# EAGLE design EurocardPowerSupply_mods (EAGLE 6.6.0)

## Sheet 1 of 3
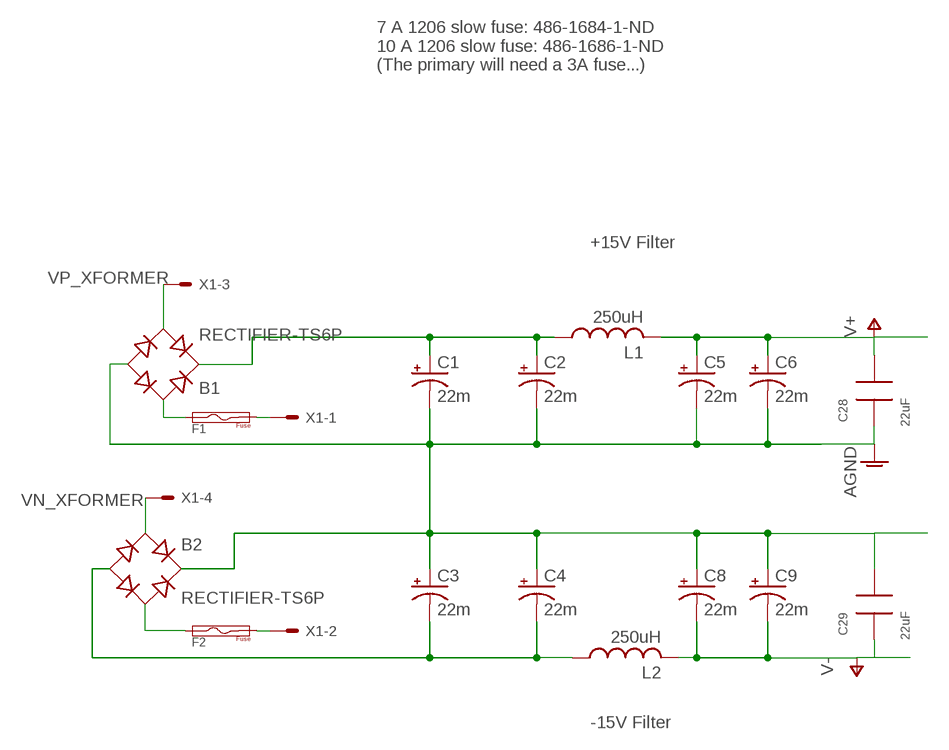
[diagram p0: schematic, sheet 1]

### Parts
B1  RECTIFIER-TS6P  [TS6P]
B2  RECTIFIER-TS6P  [TS6P]
C1  22m  CPOL-USEB35D  [EB35D]
C2  22m  CPOL-USEB35D  [EB35D]
C3  22m  CPOL-USEB35D  [EB35D]
C4  22m  CPOL-USEB35D  [EB35D]
C5  22m  CPOL-USEB35D  [EB35D]
C6  22m  CPOL-USEB35D  [EB35D]
C8  22m  CPOL-USEB35D  [EB35D]
C9  22m  CPOL-USEB35D  [EB35D]
C28  22uF  CAP1206  [1206]
C29  22uF  CAP1206  [1206]
F1  FUSE1206  [FUSE1206]
F2  FUSE1206  [FUSE1206]
L1  250uH  INDUCTOR5721-RC  [5721-RC]
L2  250uH  INDUCTOR5721-RC  [5721-RC]
X1  5566-4  [5566-4]

### Nets
AGND: B1.- B2.+ C1.- C2.- C3.+ C4.+ C5.- C6.- C8.+ C9.+ C28.1 C29.2 ; also sheet 2
N$1: B1.AC1 F1.1
N$2: F1.2 X1.1
N$3: F2.2 X1.2
N$24: B2.AC2 F2.1
V+: C5.+ C6.+ C28.2 L1.P$2 ; also sheet 2
V-: C8.- C9.- C29.1 L2.P$2 ; also sheet 2
VN_RECT: B2.- C3.- C4.- L2.P$1 ; also sheet 3
VN_XFORMER: B2.AC1 X1.4
VP_RECT: B1.+ C1.+ C2.+ L1.P$1 ; also sheet 3
VP_XFORMER: B1.AC2 X1.3

### Notes on the sheet
- 7 A 1206 slow fuse: 486-1684-1-ND
  10 A 1206 slow fuse: 486-1686-1-ND
  (The primary will need a 3A fuse...)
- +15V Filter
- -15V Filter

## Sheet 2 of 3
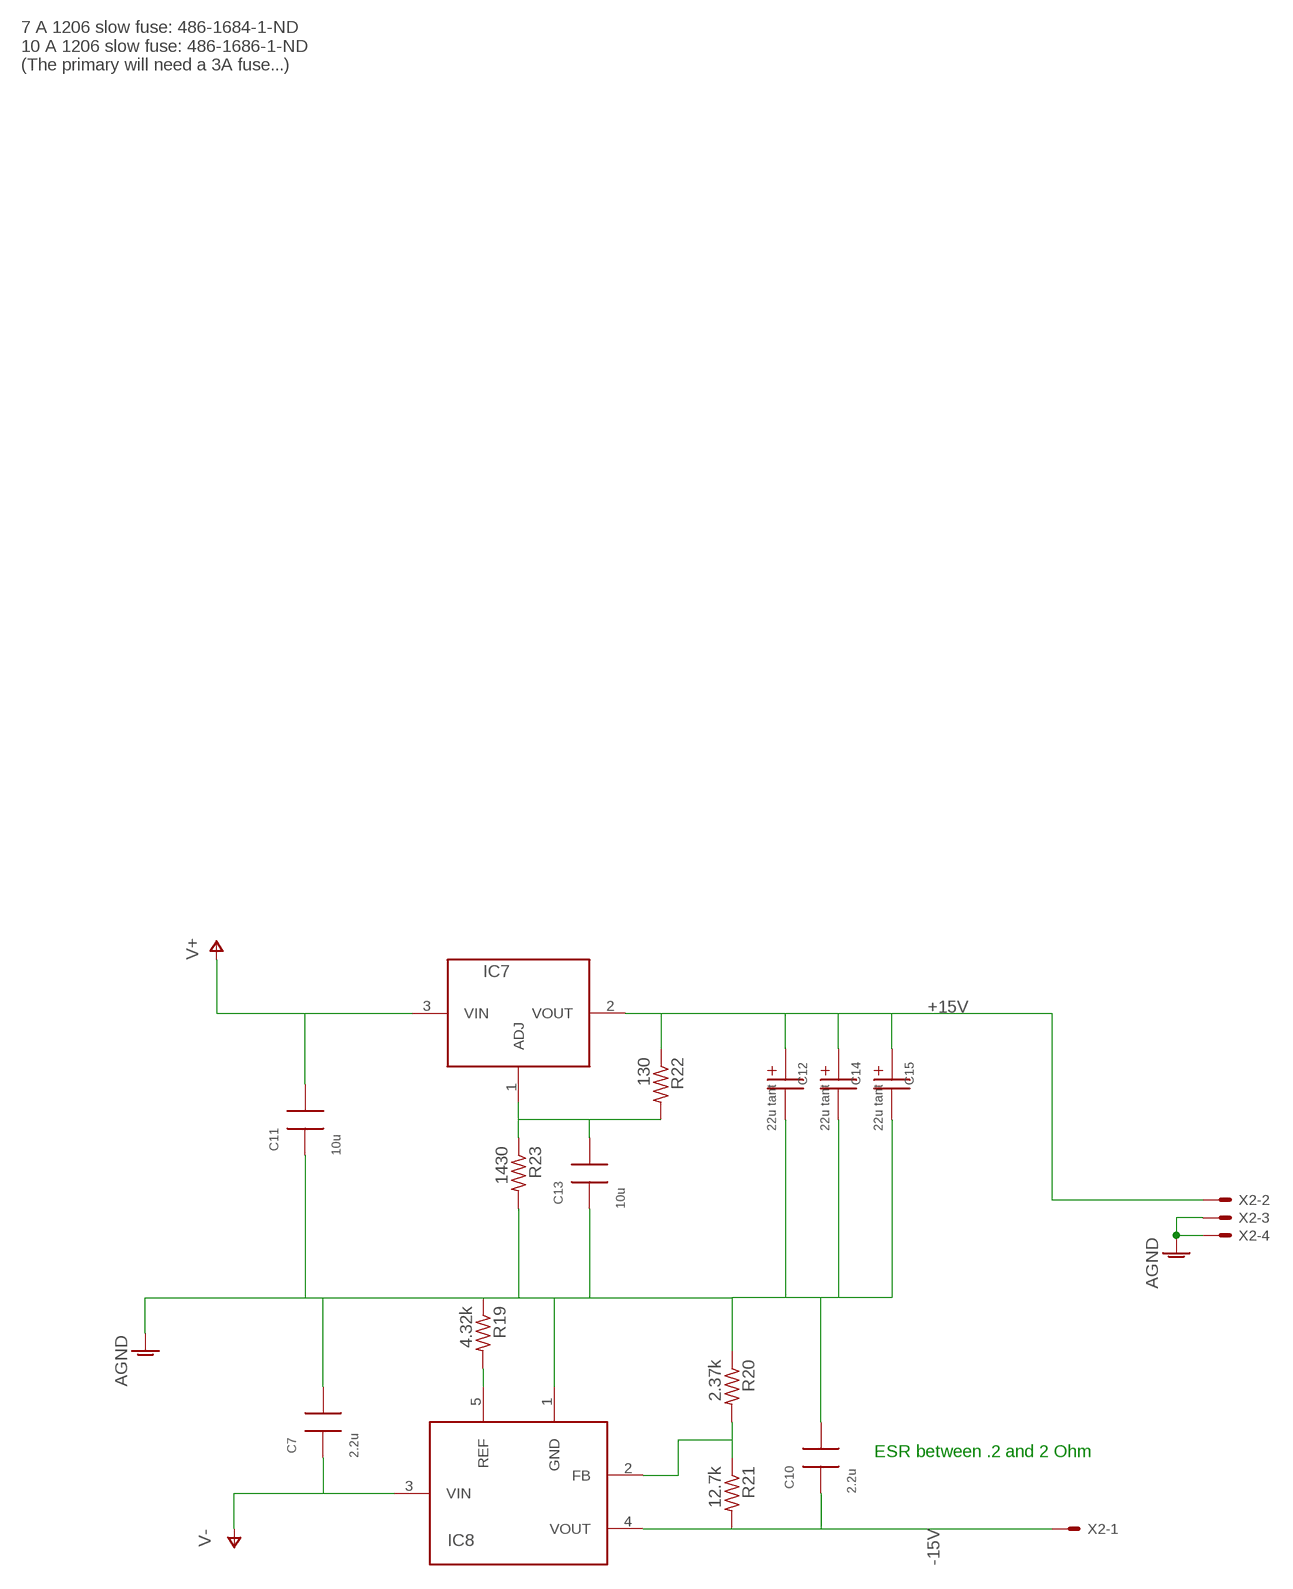
[diagram p1: schematic, sheet 2]

### Parts
C7  2.2u  CAP1206  [1206]
C10  2.2u  CAP1206  [1206]
C11  10u  CAP1206  [1206]
C12  22u tant  CAP-POL1206  [1206P]
C13  10u  CAP1206  [1206]
C14  22u tant  CAP-POL1206  [1206P]
C15  22u tant  CAP-POL1206  [1206P]
IC7  LM1084TO220  [T03B]
IC8  LT1185TO220/INLINE  [T05A]
R19  4.32k  R-US_R1206  [R1206]
R20  2.37k  R-US_R1206  [R1206]
R21  12.7k  R-US_R1206  [R1206]
R22  130  R-US_R1206  [R1206]
R23  1430  R-US_R1206  [R1206]
X2  5566-4  [5566-4]

### Nets
+15V: C12.1 C14.1 C15.1 IC7.2(VOUT) R22.1 X2.2
-15V: C10.1 IC8.4(VOUT) R21.2 X2.1
AGND: C7.2 C10.2 C11.1 C12.2 C13.1 C14.2 C15.2 IC8.1(GND) R19.1 R20.1 R23.2 X2.3 X2.4 ; also sheet 1
N$7: IC8.2(FB) R20.2 R21.1
N$9: C13.2 IC7.1(ADJ) R22.2 R23.1
N$22: IC8.5(REF) R19.2
V+: C11.2 IC7.3(VIN) ; also sheet 1
V-: C7.1 IC8.3(VIN) ; also sheet 1

### Notes on the sheet
- 7 A 1206 slow fuse: 486-1684-1-ND
  10 A 1206 slow fuse: 486-1686-1-ND
  (The primary will need a 3A fuse...)
- ESR between .2 and 2 Ohm

## Sheet 3 of 3
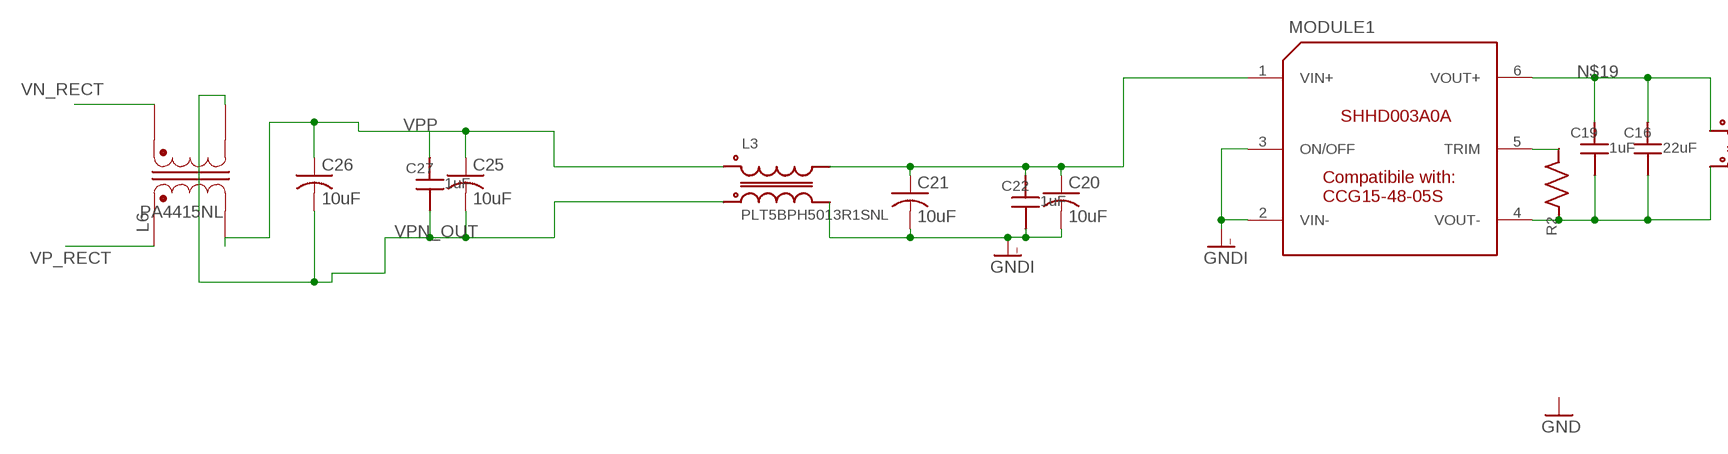
[diagram p2: schematic, sheet 3, part 1 of 2]
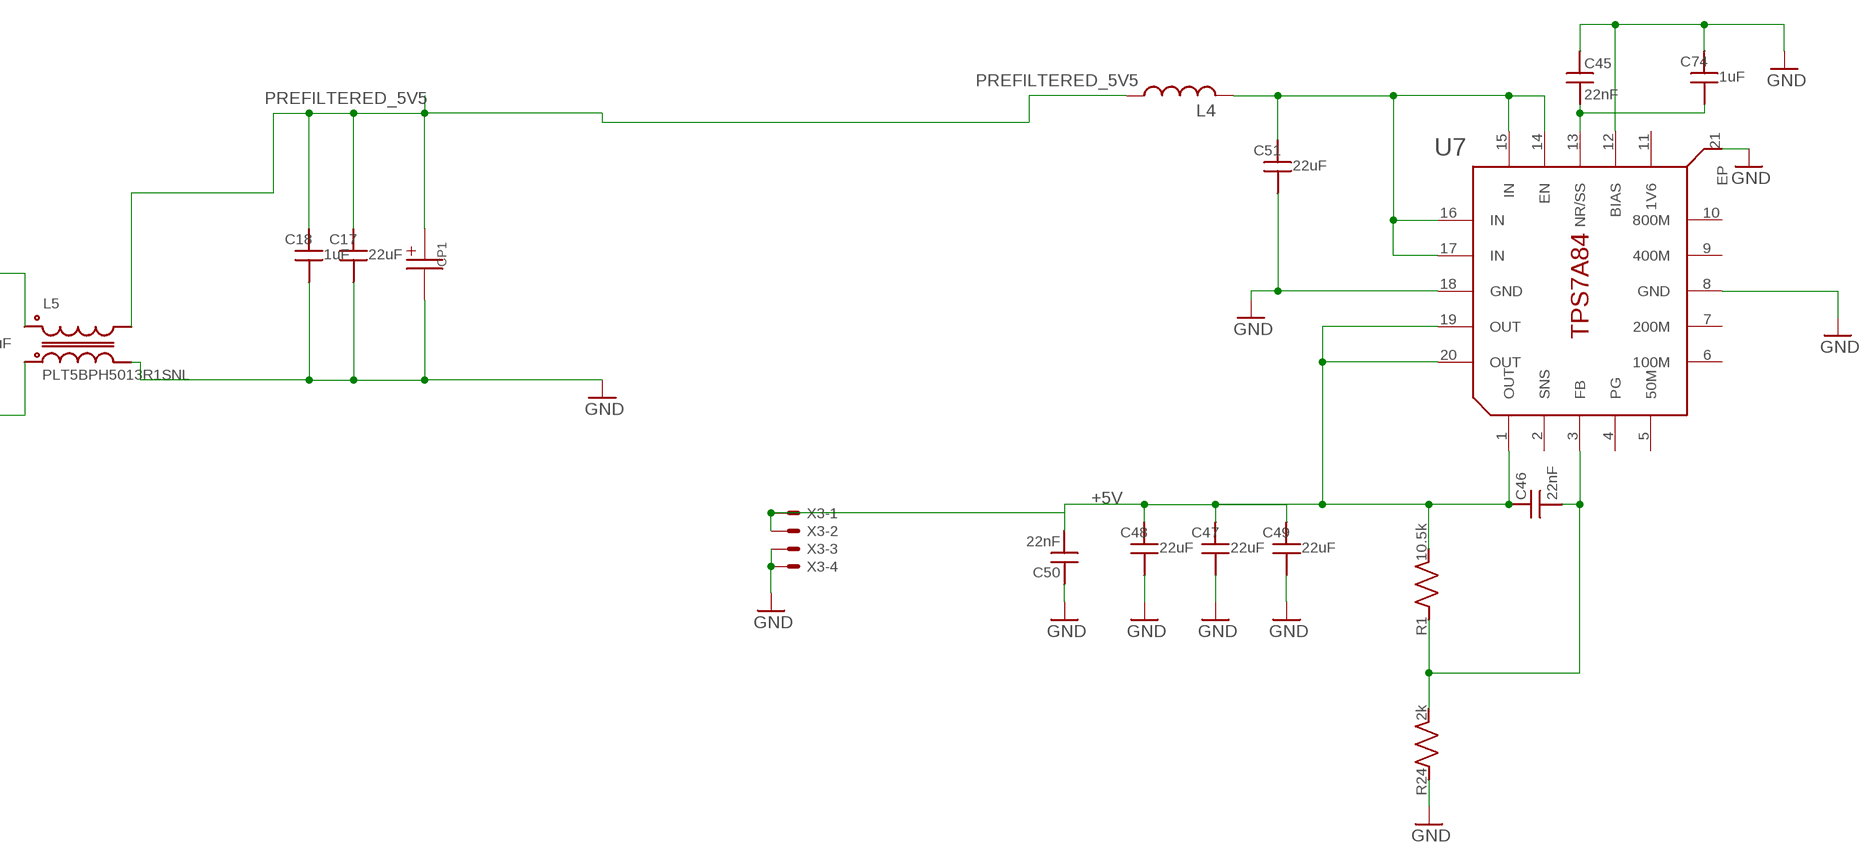
[diagram p3: schematic, sheet 3, part 2 of 2]

### Parts
C16  22uF  C_MLCC_SMDCMLCC_0805  [C_MLCC_0805]
C17  22uF  C_MLCC_SMDCMLCC_0805  [C_MLCC_0805]
C18  1uF  C_MLCC_SMDCMLCC_0805  [C_MLCC_0805]
C19  1uF  C_MLCC_SMDCMLCC_0805  [C_MLCC_0805]
C20  10uF  C-USC2220K  [C2220K]
C21  10uF  C-USC2220K  [C2220K]
C22  1uF  C_MLCC_SMDCMLCC_0805  [C_MLCC_0805]
C25  10uF  C-USC2220K  [C2220K]
C26  10uF  C-USC2220K  [C2220K]
C27  1uF  C_MLCC_SMDCMLCC_0805  [C_MLCC_0805]
C45  22nF  C_MLCC_SMDCMLCC_0306  [C_MLCC_0306]
C46  22nF  C_MLCC_SMDCMLCC_0306  [C_MLCC_0306]
C47  22uF  C_MLCC_SMDCMLCC_0805  [C_MLCC_0805]
C48  22uF  C_MLCC_SMDCMLCC_0805  [C_MLCC_0805]
C49  22uF  C_MLCC_SMDCMLCC_0805  [C_MLCC_0805]
C50  22nF  C_MLCC_SMDCMLCC_0306  [C_MLCC_0306]
C51  22uF  C_MLCC_SMDCMLCC_0805  [C_MLCC_0805]
C74  1uF  C_MLCC_SMDCMLCC_0805  [C_MLCC_0805]
CP1  CAP-POLPANASONIC_F  [PANASONIC_F]
L3  PLT5BPH5013R1SNL  MURATA_CM_COIL_SERIES_PLT5BPH  [MURATA_CM_CHOKE_PLT5BPH_SERIES]
L4  MURATA_NFZ5BBW100LN10L  [MURATA_1MHZ_3A_FERRITE]
L5  PLT5BPH5013R1SNL  MURATA_CM_COIL_SERIES_PLT5BPH  [MURATA_CM_CHOKE_PLT5BPH_SERIES]
L6  PA4415NL  [PA4415NL]
MODULE1  GE_SHHD003A0A  [GE_SHHD003A0A_THROUGH_HOLE]
R1  10.5k  R_SMDR0805  [R_0805]
R2  R_SMDR0805  [R_0805]
R24  2k  R_SMDR0805  [R_0805]
U7  TEXAS_INSTRUMENTS_TPS7A84  [S-PVQFN-N20]
X3  5566-4  [5566-4]

### Nets
+5V: C46.P$1 C47.P$1 C48.P$1 C49.P$1 C50.P$2 R1.P$2 U7.1(OUT) U7.19(OUT) U7.20(OUT) X3.1 X3.2
GND: C17.P$2 C18.P$2 C45.P$1 C47.P$2 C48.P$2 C49.P$2 C50.P$1 C51.P$2 C74.P$1 CP1.- L5.P$3 R24.P$1 U7.8(GND) U7.12(BIAS) U7.18(GND) U7.21(EP) X3.3 X3.4
GNDI: C20.2 C21.2 C22.P$2 L3.P$3 MODULE1.2(VIN-) MODULE1.3(ON/OFF)
N$10: C16.P$2 C19.P$2 L5.P$4 MODULE1.4(VOUT-) R2.P$1
N$11: MODULE1.5(TRIM) R2.P$2
N$19: C16.P$1 C19.P$1 L5.P$1 MODULE1.6(VOUT+)
N$46: C45.P$2 C74.P$2 U7.13(NR/SS)
N$47: C46.P$2 R1.P$1 R24.P$2 U7.3(FB)
N$48: C51.P$1 L4.P$2 U7.14(EN) U7.15(IN) U7.16(IN) U7.17(IN)
PREFILTERED_5V5: C17.P$1 C18.P$1 CP1.+ L4.P$1 L5.P$2
VN_RECT: L6.2 ; also sheet 1
VP_RECT: L6.1 ; also sheet 1
VPN_OUT: C25.2 C26.2 C27.P$2 L3.P$4 L6.3
VPP: C25.1 C26.1 C27.P$1 L3.P$1 L6.4
VPPI: C20.1 C21.1 C22.P$1 L3.P$2 MODULE1.1(VIN+)
Unconnected: U7.2(SNS) U7.4(PG) U7.5(50M) U7.6(100M) U7.7(200M) U7.9(400M) U7.10(800M) U7.11(1V6)

### Notes on the sheet
- Compatibile with:
  CCG15-48-05S

## Library data of the parts
B1 B2 = jqi-power-supply:RECTIFIER-: Rectifier; DIGIKEY: DFB2005-ND
C1-C6 C8 C9 = jqi-power-supply:CPOL-US; DIGIKEY: 565-2880-ND
C7 C10 C11 C13 = rlc-jqi:CAP: SMT Capacitor; DIGIKEY: 399-1249-1-ND
C12 C14 C15 = rlc-jqi:CAP-POL: Polarized SMT Capacitor; DIGIKEY: 399-1249-1-ND
C16 C17 C47-C49 C51 = jqi_passives:C_MLCC_SMD; DIGIKEY: 445-9112-1-ND
C18 C19 C22 C27 C74 = jqi_passives:C_MLCC_SMD; DIGIKEY: 587-5018-1-ND
C20 C21 C25 C26 = rcl:C-US: CAPACITOR, American symbol; DIGIKEY: 445-7947-1-ND
C28 C29 = rlc-jqi:CAP: SMT Capacitor; DIGIKEY: 445-8045-1-ND
C45 C46 C50 = jqi_passives:C_MLCC_SMD; DIGIKEY: 490-4317-1-ND
CP1 = Poe:CAP-POL: Polarized SMT Capacitor
F1 F2 = jqi-power-supply:FUSE; DIGIKEY: 486-1686-1-ND
IC7 = jqi-power-supply:LM1084: Adjustable 5A Positive Voltage Regulator; DIGIKEY: LM1084IT-ADJ/NOPB-ND
IC8 = jqi-power-supply:LT1185: Adjustable Voltage Regulator (positive/negative); DIGIKEY: LT1185CT#06PBF-ND
L1 L2 = jqi-power-supply:INDUCTOR; DIGIKEY: M8725-ND
L3 L5 = Poe:MURATA_CM_COIL_SERIES_PLT5BPH; DIGIKEY: 490-10979-1-ND; MPN: PLT5BPH5013R1SNL
L4 = Poe:MURATA_NFZ5BBW100LN10L; DIGIKEY: 490-12168-1-ND
L6 = jqi-power-supply:PA4415NL: High current common-mode choke Note: pin 3 and 4 in symbol are different from schematic in datasheet.
MODULE1 = Poe:GE_SHHD003A0A; DIGIKEY: 285-2609-ND
R1 = jqi_passives:R_SMD; DIGIKEY: 10.5k
R2 = jqi_passives:R_SMD
R19-R23 = rcl:R-US_: RESISTOR, American symbol; DIGIKEY: 541-1.5KECT-ND
R24 = jqi_passives:R_SMD; DIGIKEY: RR12P2.0KDCT-ND
U7 = Poe:TEXAS_INSTRUMENTS_TPS7A84; DIGIKEY: 296-43749-1-ND
X1-X3 = jqi-power-supply:5566-4: Mini FIT connector 4 pol Source: http://www.molex.com; OC_FARNELL: unknown; OC_NEWARK: unknown

## Board
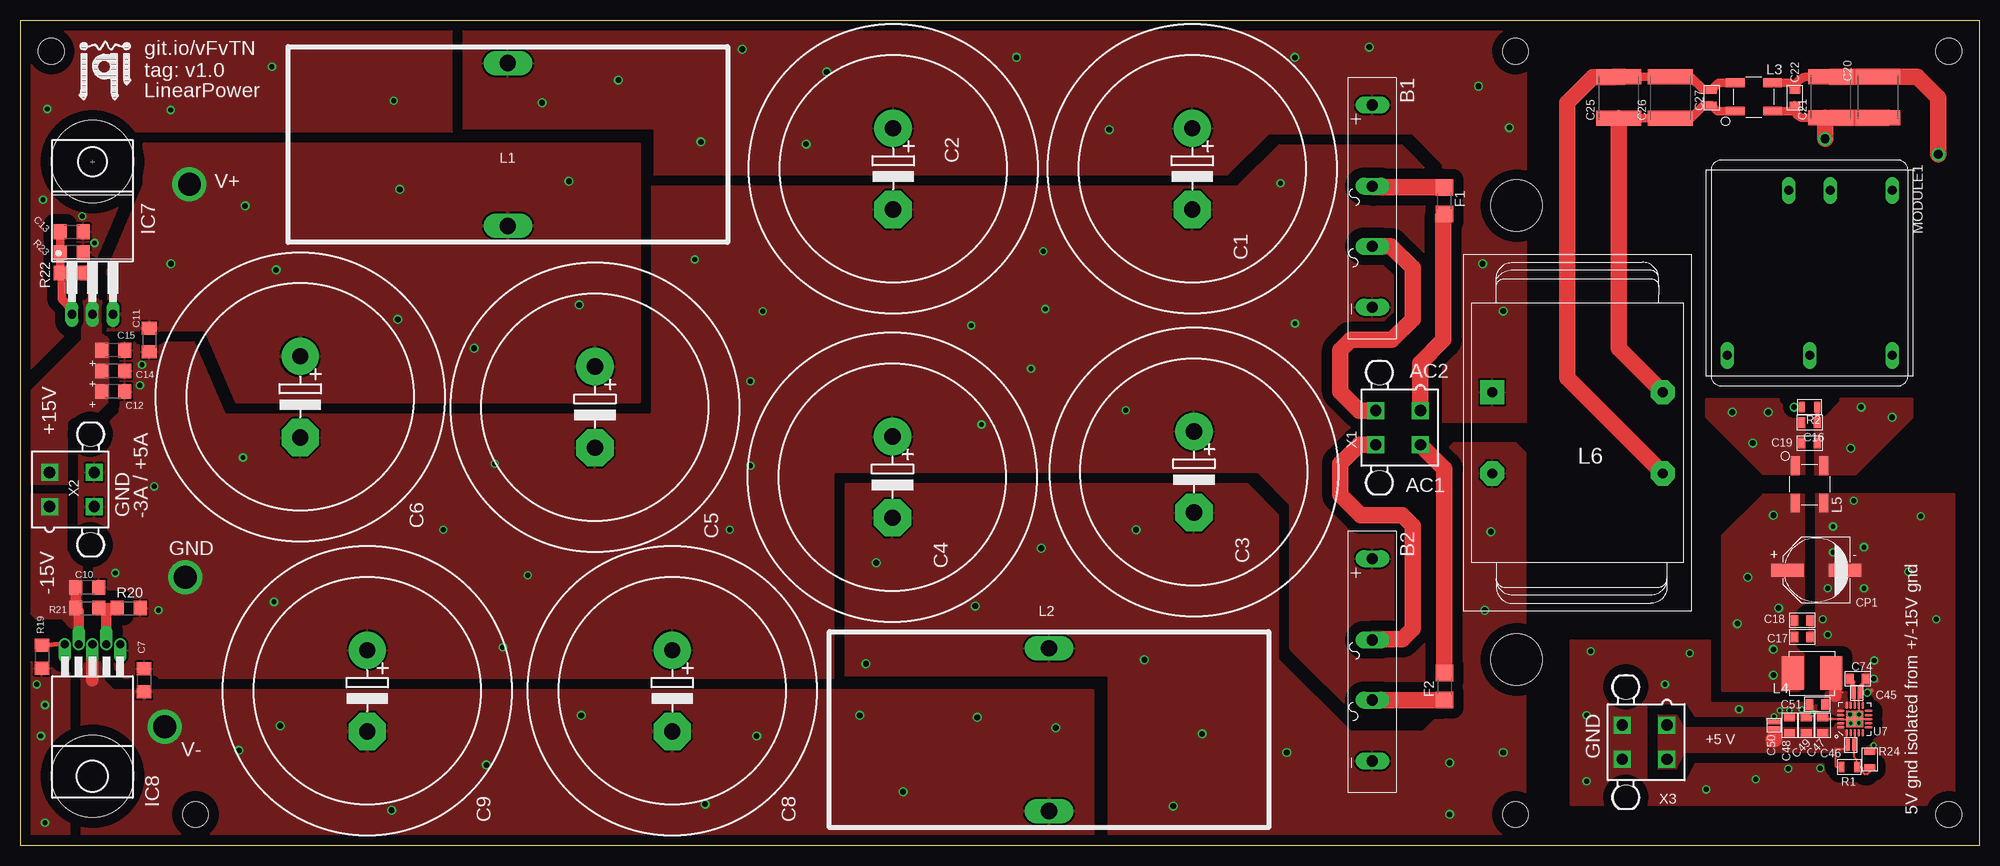
[diagram p4: board, top side]
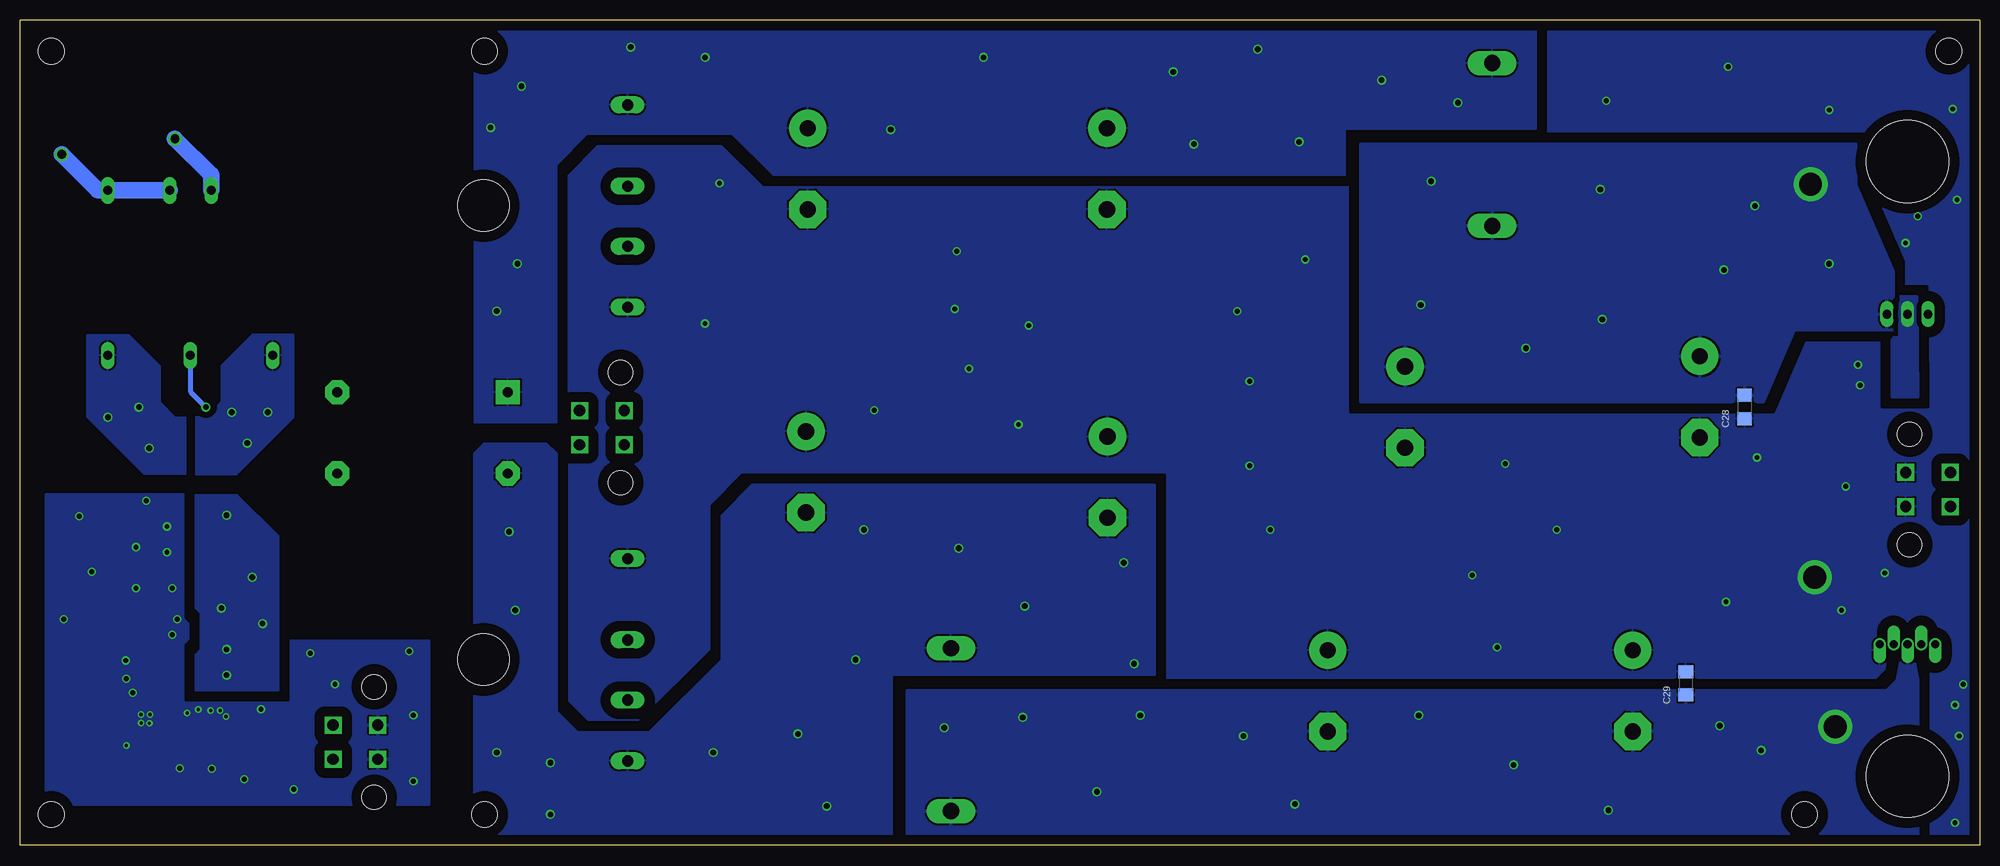
[diagram p5: board, bottom side, seen from below]

Size 241.3 x 101.6 mm. Coordinates in mm from the lower left corner, seen from the top.
Outline: 0,101.6 0,0 241.3,0 241.3,101.6 0,101.6
Copper layers (1*16): Top 0.0178mm / dielectric 12mil / Bottom 0.0178mm
Design rules "SSC-EAGLE-4Lyr_v1.0.0.3 *": minimum track width 6mil, minimum drill 8mil, track to track 6mil, track to pad 6mil, pad to pad 6mil, via to via 6mil, smd to smd 6mil, copper to edge 20mil, drill to drill 16mil, minimum pad ring 8mil, minimum via ring 8mil, stop-mask expansion 3mil, vias tented up to drill 0mil, thermal gap 10mil
Holes 3.17 mm at 3.81,97.79 21.59,3.81 237.49,97.79 184.15,3.81 184.15,97.79 237.49,3.81

### Footprints (pad centres in the part's own frame; a part is rotated, then mirrored left to right if it is on the bottom)
TS6P = drill 1.397 long: + -13.7,0; - 11.2,0; AC1 -3.7,0; AC2 3.7,0 | hole 6.35: -1.3,17.78
EB35D = drill 2.007 pad 4.597: + -5,0 | drill 2.007 pad 4.597 octagon: - 5,0
1206 = smd 1.6 x 1.803: 1 -1.422,0; 2 1.422,0
1206P = smd 1.6 x 1.803: 1 -1.422,0; 2 1.422,0
C_MLCC_0805 = smd 0.9 x 1.3: P$1 -0.95,0; P$2 0.95,0
C2220K = smd 1.85 x 5.5: 1 -2.55,0; 2 2.55,0
C_MLCC_0306 = smd 0.5 x 1.5: P$1 -0.4,0; P$2 0.4,0
PANASONIC_F = smd 4 x 1.6: + -3.55,0; - 3.55,0
FUSE1206 = smd 2.032 x 2.159: 1 -1.651,0; 2 1.651,0
T03B = drill 1.067 long: 1 -2.54,-11.43; 2 0,-11.43; 3 2.54,-11.43 | hole 10.16: 0,7.366
T05A = drill 1.016 offset: 1 -3.404,-8.89; 2 -1.702,-8.89; 3 0,-8.89; 4 1.702,-8.89; 5 3.404,-8.89 | hole 10.16: 0,7.366
5721-RC = drill 2 long: P$1 0,10.033; P$2 0,-10.033
MURATA_CM_CHOKE_PLT5BPH_SERIES = smd 1.1 x 2.3: P$1 -1.75,2.3; P$2 -1.75,-2.3; P$3 1.75,-2.3; P$4 1.75,2.3
MURATA_1MHZ_3A_FERRITE = smd 2.7 x 4.1: P$1 -2.35,0; P$2 2.35,0
PA4415NL = drill 1.2 pad 3 square: 1 -5,-10.5 | drill 1.2 pad 3 octagon: 2 5,-10.5; 3 5,10.5; 4 -5,10.5
GE_SHHD003A0A_THROUGH_HOLE = drill 1.1 long: 1 -10.16,-2.54; 2 -10.16,2.54; 3 -10.16,10.16; 4 10.16,10.16; 5 10.16,0; 6 10.16,-10.16
R_0805 = smd 0.7 x 1.3: P$1 -0.95,0; P$2 0.95,0
R1206 = smd 1.6 x 1.803: 1 -1.422,0; 2 1.422,0
S-PVQFN-N20 = smd 0.9 x 0.28: 1 -1.7,1; 2 -1.7,0.5; 3 -1.7,0; 4 -1.7,-0.5; 5 -1.7,-1; 11 1.7,-1; 12 1.7,-0.5; 13 1.7,0; 14 1.7,0.5; 15 1.7,1 | smd 0.28 x 0.9: 6 -1,-1.7; 7 -0.5,-1.7; 8 0,-1.7; 9 0.5,-1.7; 10 1,-1.7; 16 1,1.7; 17 0.5,1.7; 18 0,1.7; 19 -0.5,1.7; 20 -1,1.7 | smd 2.05 x 2.05: 21 0,0
5566-4 = drill 1.4 square: 1 2.1,-2.75; 2 -2.1,-2.75; 3 2.1,2.75; 4 -2.1,2.75 | hole 3: 6.8,2.29; -6.8,2.29

### Placement (x,y rotation side)
B1  166.5,77.47 270 top
B2  166.5,21.59 270 top
C1  144.34,83.31 270 top
C2  107.49,83.31 270 top
C3  144.53,45.97 270 top
C4  107.4,45.34 270 top
C5  70.77,53.95 270 top
C6  34.47,55.22 270 top
C7  15.24,20.32 90 top
C8  80.29,19.03 270 top
C9  42.73,19.03 270 top
C10  8.26,31.75 0 top
C11  15.88,62.23 90 top
C12  11.43,55.88 0 top
C13  6.35,75.56 180 top
C14  11.43,58.42 0 top
C15  11.43,60.96 0 top
C16  220.34,52.07 0 top
C17  219.46,25.65 0 top
C18  219.46,27.71 0 top
C19  220.34,49.53 0 top
C20  228.78,92.18 90 top
C21  222.96,92.13 90 top
C22  218.54,92.08 90 top
C25  196.85,92.08 90 top
C26  203.2,92.08 90 top
C27  208.28,92.08 90 top
C28  28.96,53.98 90 bottom
C29  36.2,19.94 90 bottom
C45  226.16,18.77 180 top
C46  225.43,12.37 0 top
C47  221.97,14.78 90 top
C48  217.88,14.78 90 top
C49  219.94,14.78 90 top
C50  215.98,14.78 270 top
C51  221.28,17.35 180 top
C74  226.29,20.5 180 top
CP1  221.18,33.88 0 top
F1  175.39,79.38 270 top
F2  175.39,19.56 90 top
IC7  8.89,76.83 0 top
IC8  8.89,15.88 180 top
L1  60.05,86.31 0 top
L2  126.69,14.24 0 top
L3  213.49,92.18 90 top
L4  220.65,21.21 0 top
L5  220.34,44.45 0 top
L6  191.77,50.8 270 top
MODULE1  220.34,70.48 270 top
R1  225.22,9.63 180 top
R2  220.34,53.98 180 top
R19  2.67,23.24 90 top
R20  13.34,29.21 180 top
R21  8.26,29.21 180 top
R22  6.35,70.48 180 top
R23  6.35,73.03 0 top
R24  227.76,10.57 270 top
U7  225.91,15.54 90 top
U$1  [JQI_LOGO_POSITIVE-SILKSCREEN]  6.99,92.08 0 top
X1  169.67,51.44 90 top
X2  6.35,43.81 270 top
X3  200.03,12.7 90 top

### Tracks (layer width: path | path; a pad name or v marks a point on that pad's centre or on a via)
+5V
  Top 0.152: U7.1 224.91,13.85 224.79,13.97
  Top 0.254: 224.93,12.46 C46.P$1 224.57,11.91 223.52,11.91 223.54,11.89 223.54,9.73 223.65,9.63 R1.P$2
  Top 1.016: 216.03,13.13 216.15,13.26
  Top 2.032: 215.95,13.06 216.03,13.13
  pour Top (isolate 0.254, no thermals): 225.04,11.43 225.04,14.22 224.54,14.22 224.54,14.99 223.52,14.99 223.27,14.48 204.98,14.48 203.96,16 201.68,16 201.68,9.4 203.96,9.4 204.98,11.43
+15V
  Top 1.016: IC7.2 8.89,69.85 8.26,70.48 R22.1
  pour Bottom (isolate 0.61, rank 2, no thermals): 10.67,67.56 10.54,62.23 10.79,62.23 10.79,55.24 7.62,55.24 7.75,67.56
  pour Top (isolate 0.61, rank 2, no thermals): 10.67,66.93 10.54,62.23 10.79,62.23 10.79,55.24 7.62,55.24 7.75,66.93
  pour Top (isolate 1.27, no thermals): 8.26,67.31 9.53,67.31 10.16,66.67 10.16,62.87 10.79,62.23 10.79,54.61 8.89,52.7 6.35,52.7 5.71,52.07 5.71,44.45 0,44.45 0,54.61 7.62,62.23 7.62,66.67
-15V
  Top 1.27: IC8.4 7.19,28.86 R21.2 C10.1
  pour Top (isolate 1.27, no thermals): 7.62,26.67 7.62,34.29 5.71,36.2 5.71,43.18 0,43.18 0,29.84 1.91,27.94 5.08,27.94 6.35,26.67
AGND  (via drill 0.6, 2.8)
  other vias: 20.32,33.02 7.62,77.47 9.14,74.17 2.79,79.5 14.99,59.18 14.73,56.64 17.02,28.96 11.68,33.53 2.03,19.81 3.05,17.27 52.07,38.86 62.48,33.27 91.44,65.79 83.06,72.14 87.38,38.86 125.98,73.15 126.24,66.04 117.09,64.01 124.46,58.67 89.92,57.15 156.97,64.26 155.19,81.53 136.14,53.59 118.36,51.82 89.92,46.74 58.42,46.99 31.24,29.97 2.54,13.46 3.05,2.79 18.54,90.55 3.3,90.68 30.99,95.89 45.97,91.69 16.51,44.2 27.43,47.75 59.44,24.38
  pour Top (isolate 1.27, rank 3): 185.42,0 0,0 0,101.6 185.42,101.6
  pour Bottom (isolate 1.27, rank 3): 185.42,0 185.42,101.6 0,101.6 0,0
GND  (via drill 0.38, 0.38 pad 0.3, 0.41, 0.6)
  Top 0.254: 226.58,15.54 226.57,15.54 226.77,15.57 226.44,15.93 v226.44,16.1 226.44,16.03 226.43,16.02 226.01,15.6 | v225.32,16.1 225.45,16.13 225.91,16.2 U7.21 225.53,15.54 225.53,15.52 225.3,15.54 225.91,15.52 | v225.4,15.04 v226.42,15.06 | 226.06,15.88 226.41,16.22 U7.12 226.42,18.52 226.56,18.52 C45.P$1 | 226.06,15.88 225.73,15.54 U7.18 222.61,15.54 | U7.8 226.39,15.54 226.06,15.88
  Top 0.508: v228.24,12.29 227.79,11.54 R24.P$1 | 227.97,19.05 227.69,18.77 C45.P$1 226.56,19.55 227.33,20.32 228.6,20.32
  other vias: 215.98,15.88 217.86,16.61 216.69,16.59 219.38,16.71 221.67,9.47 217.73,9.42 213.72,8.15 211.66,16.74 227.46,18.77 228.24,20.5 220.75,16.28 227.05,36.73 227.05,31.65 222.61,31.65 223.24,36.09 225.78,42.44 223.24,39.27 234.04,40.54 235.94,27.84 221.97,27.84 222.61,25.93 228.32,22.76 207.62,6.88 192.89,7.9 192.89,16.03 205.59,23.65 193.4,23.9 202.54,19.84 232.51,33.68
  pour Top (no thermals): 216.46,17.35 220.52,17.3 221.18,17.27 221.18,16.48 221.41,16.26 222.17,16.26 222.28,16.15 222.3,16.15 222.76,15.7 223.16,15.7 223.29,15.57 223.29,15.49 223.09,15.42 222.15,15.39 222.63,15.54 217.07,15.54 216.61,15.34 215.09,15.34 215.01,15.93 214.81,16.15
  pour Bottom (isolate 1.27, rank 2): 238.12,5.08 191.01,5.08 191.01,25.15 209.3,25.15 209.55,43.18 238.12,43.18
  pour Top (isolate 1.27, rank 2, no thermals): 238.12,5.08 191.01,5.08 191.01,25.15 209.55,25.15 209.55,43.18 238.12,43.18
GNDI  (via drill 1.1)
  Top 1.016: L3.P$3 217.64,93.93 arc-90 C22.P$2 arc-90 220.19,94.68 C21.2 | 230,94.68 arc90 C20.2
  Top 2.032: C21.2 230,94.68 233.62,94.68 236.22,92.08 v236.22,85.09
  Bottom 2.032: v236.22,85.09 231.78,80.64 MODULE1.3 MODULE1.2
N$1
  Top 2.032: F1.1 166.64,81.03 B1.AC1
N$2
  Top 2.032: X1.1 172.42,59.39 175.26,62.23 175.26,77.6 F1.2
N$3
  Top 2.032: F2.2 175.39,46.37 X1.2
N$7
  Top 1.27: IC8.2 10.59,28.78 10.16,29.21 R21.1 R20.2
N$9
  Top 1.016: IC7.1 6.35,66.04 5.08,67.31 5.08,70.33 R22.2 R23.1 C13.2
N$10  (via drill 0.7)
  Top 0.61: R2.P$1 C16.P$2
  other vias: 226.69,53.98 230.5,52.7 225.43,48.9
  pour Top (isolate 0.762, no thermals): 233.04,54.99 224.16,54.99 224.16,54.61 222.25,52.7 220.98,52.7 220.98,45.72 226.06,45.72 233.04,52.7
  pour Bottom (isolate 0.762): 233.04,62.87 227.97,62.87 224.16,59.05 224.16,54.61 222.25,52.7 220.98,52.7 220.98,45.72 226.06,45.72 233.04,52.7
N$11  (via drill 0.7)
  Top 0.61: v218.44,53.98 R2.P$2
  Bottom 0.61: MODULE1.5 220.34,55.88 v218.44,53.98
N$19  (via drill 0.7)
  other vias: 210.82,53.34 215.26,53.34 213.36,49.53
  pour Top (isolate 0.762, no thermals): 207.65,54.99 216.53,54.99 216.53,54.61 218.44,52.7 219.71,52.7 219.71,45.72 214.63,45.72 207.65,52.7
  pour Bottom (isolate 0.762): 207.65,62.87 212.72,62.87 216.53,59.05 216.53,54.61 218.44,52.7 219.71,52.7 219.71,45.72 214.63,45.72 207.65,52.7
N$22
  Top 0.61: IC8.5 R19.2
N$24
  Top 1.524: 175.37,17.89 F2.1
  Top 2.032: B2.AC2 175.37,17.89
N$46
  Top 0.254: C45.P$2 225.75,18.06 225.93,17.88 225.91,17.86 U7.13
  Top 0.508: C45.P$2 225.75,20.08 C74.P$2
N$47
  Top 0.254: R24.P$2 227.76,9.02 227.48,8.74 227.13,8.74 226.87,8.99 226.87,9.4 226.67,9.6 226.2,9.6 R1.P$1 226.16,10.54 225.83,10.87 C46.P$2 | 225.93,12.48 C46.P$2 | U7.3 225.91,12.45 C46.P$2
N$48
  Top 0.254: 224.43,18.82 224.03,18.82 | 223.93,18.39 223.93,18.72 224.03,18.82 | 223.52,18.41 223.93,18.82 224.03,18.82
  Top 1.524: L4.P$2 223.52,20.69 223.52,18.41
  pour Top (no thermals): 222.15,17.65 222.15,17.17 222.45,16.87 222.78,16.87 223.04,16.74 223.16,16.28 223.67,16.03 224,16.03 224.36,16.05 224.36,16.54 224.33,17.02 225.43,17.02 225.4,17.6 224.97,17.58 224.94,18.82 222.4,18.85 222.25,18.62 222.22,17.73
PREFILTERED_5V5  (via drill 0.7)
  other vias: 212.72,33.02 215.9,40.64 216.53,29.21 215.9,24.13 215.9,20.95 211.46,27.3
  pour Top (isolate 1.27, no thermals): 219.71,43.18 214.63,43.18 209.55,38.1 209.55,19.05 219.71,19.05 219.71,23.5 219.07,24.13 219.07,28.57 219.71,29.21
  pour Bottom (isolate 1.27, no thermals): 219.71,43.18 214.63,43.18 209.55,38.1 209.55,19.05 219.71,19.05 219.71,23.5 219.07,24.13 219.07,28.57 219.71,29.21
V+  (via drill 0.7, 2.8)
  other vias: 20.83,81.41 67.56,81.79 68.83,66.55 55.88,61.21 46.74,80.77 27.69,78.74 18.54,71.63 46.48,64.77 31.5,70.87
  pour Top (isolate 1.27): 10.67,70.36 10.67,63.5 22.86,63.5 26.67,54.61 76.2,54.61 76.2,86.36 15.24,86.36 15.24,81.28
  pour Bottom (isolate 1.27): 10.67,70.61 10.67,63.5 22.86,63.5 26.67,54.61 76.2,54.61 76.2,86.36 15.24,86.36 15.24,81.28
V-  (via drill 0.7, 2.8)
  Top 1.524: IC8.3 8.89,20.32
  other vias: 17.78,14.61 57.4,9.91 90.68,13.46 117.86,15.75 127.51,14.48 108.71,6.6 103.38,16 84.33,5.08 69.09,16 45.72,4.32 32,14.73 26.92,11.68
  pour Top (isolate 1.27): 132.08,1.27 132.08,19.05 11.43,19.05 10.16,20.32 9.53,23.5 8.26,23.5 7.62,20.32 7.62,1.02
  pour Bottom (isolate 1.27): 132.08,1.27 132.08,19.05 11.43,19.05 10.16,20.32 9.53,23.5 8.26,23.5 7.62,20.32 7.62,1.02
VN_RECT  (via drill 0.7)
  other vias: 145.54,13.72 138.43,22.86 125.73,36.58 117.6,29.46 104.14,22.35 105.41,34.8 137.41,38.86 155.96,11.43 141.99,4.83 182.63,11.43 176.02,3.81 181.1,38.61 180.34,28.96 176.02,10.16
  pour Top (isolate 1.27): 184.15,49.53 176.53,49.53 175.26,48.26 175.26,16.51 172.72,13.97 163.83,13.97 154.94,22.86 154.94,40.64 151.13,44.45 101.6,44.45 101.6,20.95 133.99,20.95 133.99,0 185.42,0 185.42,48.26
  pour Bottom (isolate 1.27): 184.15,49.53 176.53,49.53 175.26,48.26 175.26,16.51 172.72,13.97 163.83,13.97 154.94,22.86 154.94,40.64 151.13,44.45 101.6,44.45 101.6,20.95 133.99,20.95 133.99,-0.64 185.42,0 185.42,48.26
VN_XFORMER
  Top 1.524: 166.61,25.4 B2.AC1
  Top 2.032: X1.4 164.91,49.34 162.56,46.99 162.56,43.18 165.1,40.64 170.18,40.64 171.45,39.37 171.45,26.67 170.18,25.4 166.61,25.4
VP_RECT  (via drill 0.7)
  other vias: 179.58,93.47 166.12,98.3 182.63,65.79 183.39,88.39 156.97,97.03 134.11,88.14 122.68,97.03 99.31,95.25 83.82,86.61 73.66,94.23 88.9,98.04 64.26,91.44 96.77,86.36 180.09,71.63
  pour Top (isolate 1.27): 185.42,52.07 175.26,52.07 175.26,83.82 171.45,87.63 153.67,87.63 148.59,82.55 78.11,82.55 78.11,88.27 54.61,88.27 54.61,101.6 185.42,101.6
  pour Bottom (isolate 1.27): 185.42,52.07 175.26,52.07 175.26,83.82 171.45,87.63 153.67,87.63 148.59,82.55 78.11,82.55 78.11,88.27 54.61,88.27 54.61,101.6 185.42,101.6
VP_XFORMER
  Top 2.032: X1.3 164.91,53.53 162.56,55.88 162.56,60.96 163.83,62.23 168.91,62.23 171.45,64.77 171.45,71.12 168.8,73.77 B1.AC2
VPN_OUT
  Top 1.016: L3.P$4 209.18,93.93 C27.P$2 207.33,93.03 205.74,94.61 C26.2 197.49,94.62 C25.2
  Top 2.032: L6.3 190.5,57.57 190.5,91.44 193.68,94.61 196.22,94.61 196.22,94.62 197.49,94.62
VPP
  Top 1.016: L3.P$1 208.98,90.43 C27.P$1 207.33,91.12 205.74,89.53 C26.1 C25.1
  Top 2.032: L6.4 196.85,61.22 C25.1
VPPI  (via drill 1.1)
  Top 1.016: L3.P$2 218.06,90.43 arc90 218.44,90.81 | 218.44,90.81 218.44,91.02 arc-90 C22.P$1 | C21.1 222.25,89.58 219.67,89.58 arc-90 218.44,90.81 | 230,89.58 arc90 C20.1
  Top 2.032: C21.1 230,89.58 | v222.25,87 222.25,89.58
  Bottom 2.032: MODULE1.1 217.81,82.55 v222.25,87

### Text on the board
tPlace: git.io/vFvTN / tag: v1.0 | LinearPower | AC2 | -3A / +5A | AC1 | +5 V | GND | 5V gnd isolated from +/-15V gnd
tNames: V+ | +15V | GND | GND | -15V | V-